# EAGLE design DAQ (EAGLE 7.6.0)
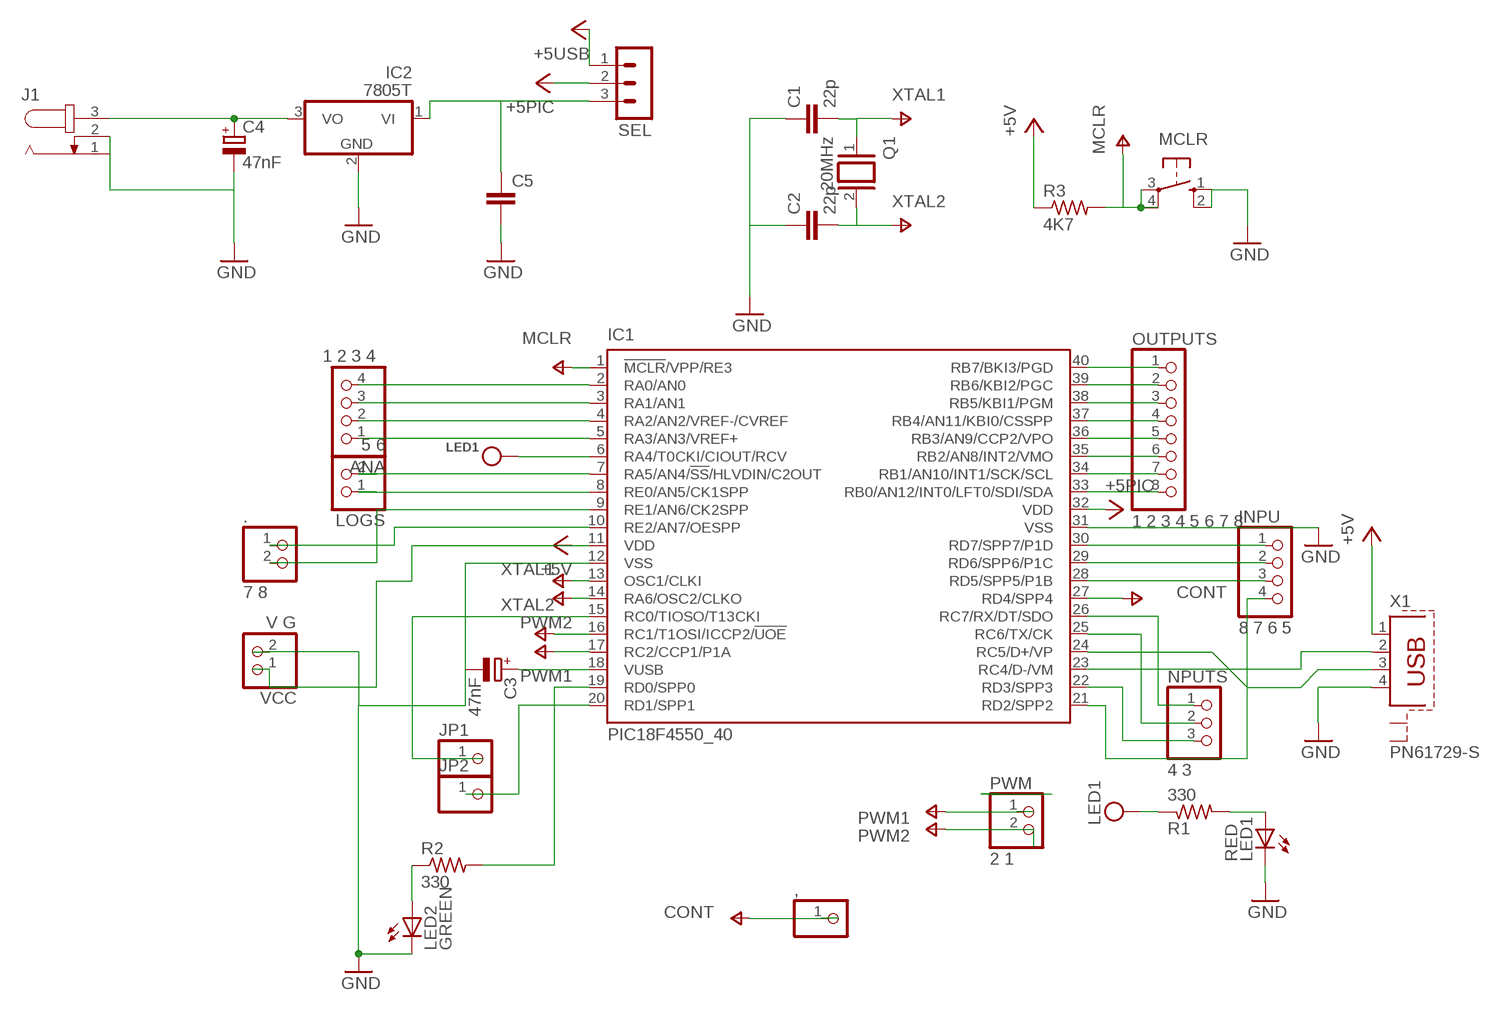
[diagram p0: schematic, sheet 1]

## Parts
,  PINHD-1X1  [1X01]
.  7 8  PINHD-1X2  [1X02]
ANA  1 2 3 4  PINHD-1X4  [1X04]
C1  22p  C-EU025-024X044  [C025-024X044]
C2  22p  C-EU025-024X044  [C025-024X044]
C3  47nF  CPOL-EUE2,5-6E  [E2,5-6E]
C4  47nF  CPOL-EUE2,5-6E  [E2,5-6E]
C5  C-EU050-035X075  [C050-035X075]
IC1  PIC18F4550_40  [DIL40]
IC2  7805T  [TO220H]
INPU  8 7 6 5  PINHD-1X4  [1X04]
J1  JACK-PLUG0  [SPC4077]
JP1  PINHD-1X1  [1X01]
JP2  PINHD-1X1  [1X01]
LED1  RED  TLLR4400  [LED3MM]
LED2  GREEN  TLLG4400  [LED3MM]
LOGS  5 6  PINHD-1X2  [1X02]
MCLR  10-XX  [B3F-10XX]
NPUTS  4 3  PINHD-1X3  [1X03]
OUTPUTS  1 2 3 4 5 6 7 8  PINHD-1X8  [1X08]
PWM  2 1  PINHD-1X2  [1X02]
Q1  20MHz  XTAL/S  [QS]
R1  330  R-US_0207/10  [0207/10]
R2  330  R-US_0207/10  [0207/10]
R3  4K7  R-US_0207/10  [0207/10]
SEL  MA03-1  [MA03-1]
VCC  V G  PINHD-1X2  [1X02]
X1  PN61729-S  [PN61729-S]

## Nets
+5PIC: IC1.11(VDD) IC1.32(VDD) R3.1 SEL.2 VCC.1 ; supply symbol labelled +5V
+5USB: SEL.1 X1.1 ; supply symbol labelled +5V
GND: C1.1 C2.1 C3.- C4.- C5.2 IC1.12(VSS) IC1.31(VSS) IC2.2(GND) J1.1 J1.2 LED1.K(C) LED2.K(C) MCLR.1(S) MCLR.2(S1) VCC.2 X1.4
MCLR: IC1.1(!MCLR!/VPP/RE3) MCLR.3(P) MCLR.4(P1) R3.2
N$1: IC1.23(RC4/D-/VM) X1.2
N$2: IC1.30(RD7/SPP7/P1D) INPU.1
N$3: IC1.40(RB7/BKI3/PGD) OUTPUTS.1
N$5: LED2.A R2.1
N$6: IC1.25(RC6/TX/CK) NPUTS.2
N$7: LED1.A R1.2
N$8: IC1.39(RB6/KBI2/PGC) OUTPUTS.2
N$9: IC1.38(RB5/KBI1/PGM) OUTPUTS.3
N$10: IC1.37(RB4/AN11/KBI0/CSSPP) OUTPUTS.4
N$11: IC1.36(RB3/AN9/CCP2/VPO) OUTPUTS.5
N$12: IC1.35(RB2/AN8/INT2/VMO) OUTPUTS.6
N$13: IC1.34(RB1/AN10/INT1/SCK/SCL) OUTPUTS.7
N$14: IC1.33(RB0/AN12/INT0/LFT0/SDI/SDA) OUTPUTS.8
N$15: IC1.24(RC5/D+/VP) X1.3
N$16: IC1.29(RD6/SPP6/P1C) INPU.2
N$17: IC1.28(RD5/SPP5/P1B) INPU.3
N$18: IC1.22(RD3/SPP3) NPUTS.3
N$19: IC1.15(RC0/TIOSO/T13CKI) JP1.1
N$20: C3.+ IC1.18(VUSB)
N$21: IC1.21(RD2/SPP2) INPU.4
N$22: IC1.19(RD0/SPP0) R2.2
N$23: ANA.4 IC1.2(RA0/AN0)
N$24: ANA.3 IC1.3(RA1/AN1)
N$25: ANA.2 IC1.4(RA2/AN2/VREF-/CVREF)
N$26: ANA.1 IC1.5(RA3/AN3/VREF+)
N$27: IC1.7(RA5/AN4/!SS!/HLVDIN/C2OUT) LOGS.2
N$28: IC1.8(RE0/AN5/CK1SPP) LOGS.1
N$29: IC1.20(RD1/SPP1) JP2.1
N$31: ..2 IC1.9(RE1/AN6/CK2SPP)
N$32: ..1 IC1.10(RE2/AN7/OESPP)
N$131: C4.+ IC2.3(VO) J1.3
N$132: C5.1 IC2.1(VI) SEL.3
N$137: IC1.26(RC7/RX/DT/SDO) NPUTS.1
PWM1: IC1.17(RC2/CCP1/P1A) PWM.1
PWM2: IC1.16(RC1/T1OSI/ICCP2/!UOE) PWM.2
V+: ,.1 IC1.27(RD4/SPP4) ; supply symbol labelled CONT
VCC: IC1.6(RA4/T0CKI/CIOUT/RCV) R1.1 ; supply symbol labelled LED1
XTAL1: C1.2 IC1.13(OSC1/CLKI) Q1.1
XTAL2: C2.2 IC1.14(RA6/OSC2/CLKO) Q1.2
Unconnected: X1.S1 X1.S2

## Library data of the parts
, JP1 JP2 = pinhead:PINHD-1X1: PIN HEADER
. LOGS PWM VCC = pinhead:PINHD-1X2: PIN HEADER
ANA INPU = pinhead:PINHD-1X4: PIN HEADER
C1 C2 C5 = rcl:C-EU: CAPACITOR, European symbol
C3 C4 = resistor:CPOL-EU: POLARIZED CAPACITOR, European symbol
IC1 = microchip:PIC18F4*_40: USB Microcontrollers with nanoWatt Technology High-Performance, Enhanced Flash, 28/40/44-Pin, Source: http://ww1.microchip.com/downloads/en/devicedoc/39632c.pdf; MF: MICROCHIP; MPN: PIC18F4550-I/P; OC_FARNELL: 9321357; OC_NEWARK: 74K8623
IC2 = linear:78*: Positive VOLTAGE REGULATOR Source: http://cache.national.com/ds/LM/LM78L05.pdf http://www.fairchildsemi.com/ds/LM/LM7805.pdf
J1 = con-jack:JACK-PLUG: DC POWER JACK Power Jack, DC, Right Angle, Through Hole, Rated 5A at 16VDC, PC Terminals Distributor: Farnell (www.Farnell.de) Drawing: 84N1161.pdf / 84N1162.pdf Manufacturer: SPC Technology (www.spctechnology.com) Type: SPC4077 / SPC 4078; OC_FARNELL: unknown; OC_NEWARK: unknown
LED1 = led:TLLR4400: Low Current (2mA) LED 3 mm Tinted Diffused Package color RED Source: Data sheet <http://www.farnell.com/datasheets/391100.pdf>; MF: VISHAY SEMICONDUCTOR; OC_FARNELL: 1612437
LED2 = led:TLLG4400: Low Current (2mA) LED 3 mm Tinted Diffused Package color GREEN Source: Data sheet <http://www.farnell.com/datasheets/391098.pdf>; MF: VISHAY SEMICONDUCTOR; OC_FARNELL: 1612435
MCLR = switch-omron:10-XX: OMRON SWITCH; MPN: B3F-1000; OC_FARNELL: 176432; OC_NEWARK: 36M3542
NPUTS = pinhead:PINHD-1X3: PIN HEADER
OUTPUTS = pinhead:PINHD-1X8: PIN HEADER
Q1 = special:XTAL/S: CRYSTAL
R1-R3 = resistor:R-US_: RESISTOR, American symbol
SEL = con-lstb:MA03-1: PIN HEADER; OC_FARNELL: unknown; OC_NEWARK: unknown
X1 = con-berg:PN61729-S: BERG USB connector; OC_FARNELL: unknown; OC_NEWARK: unknown

## Board
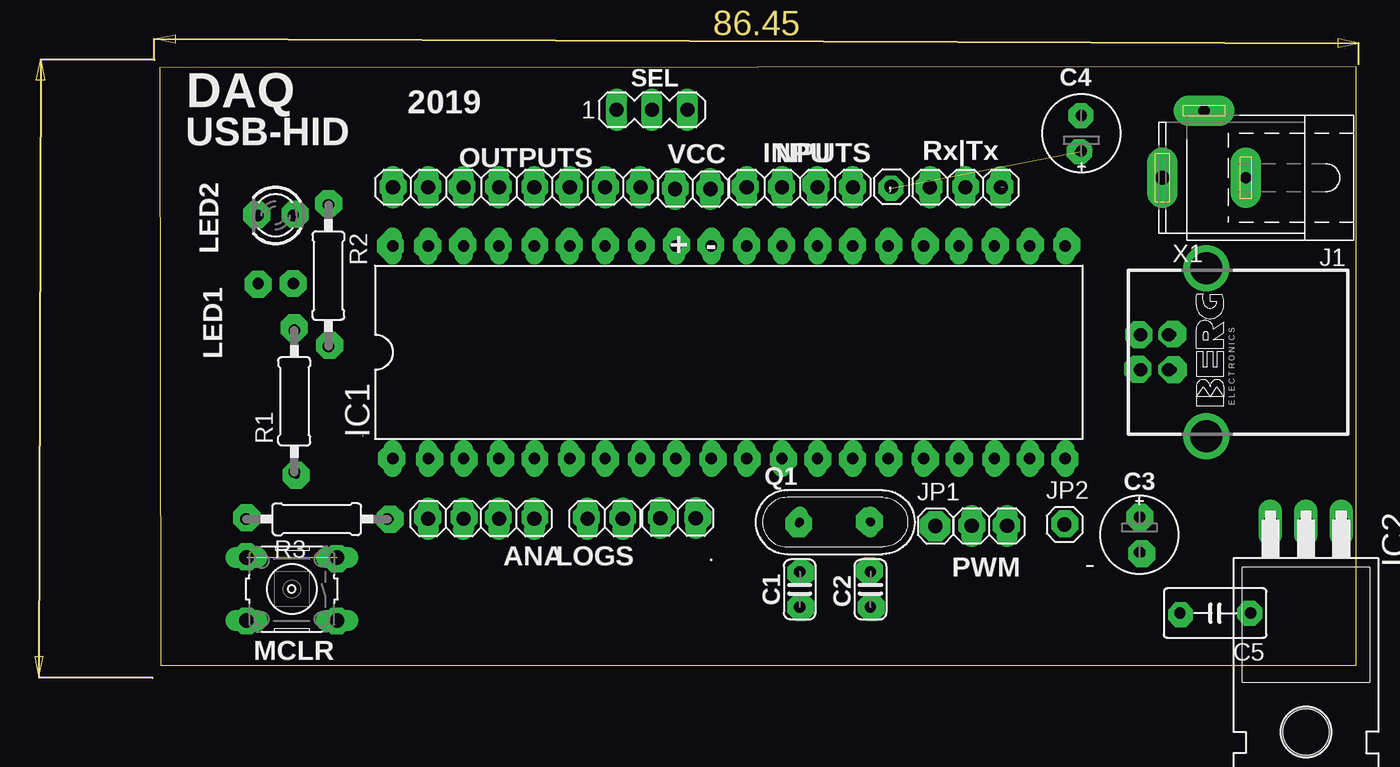
[diagram p1: board, top side]
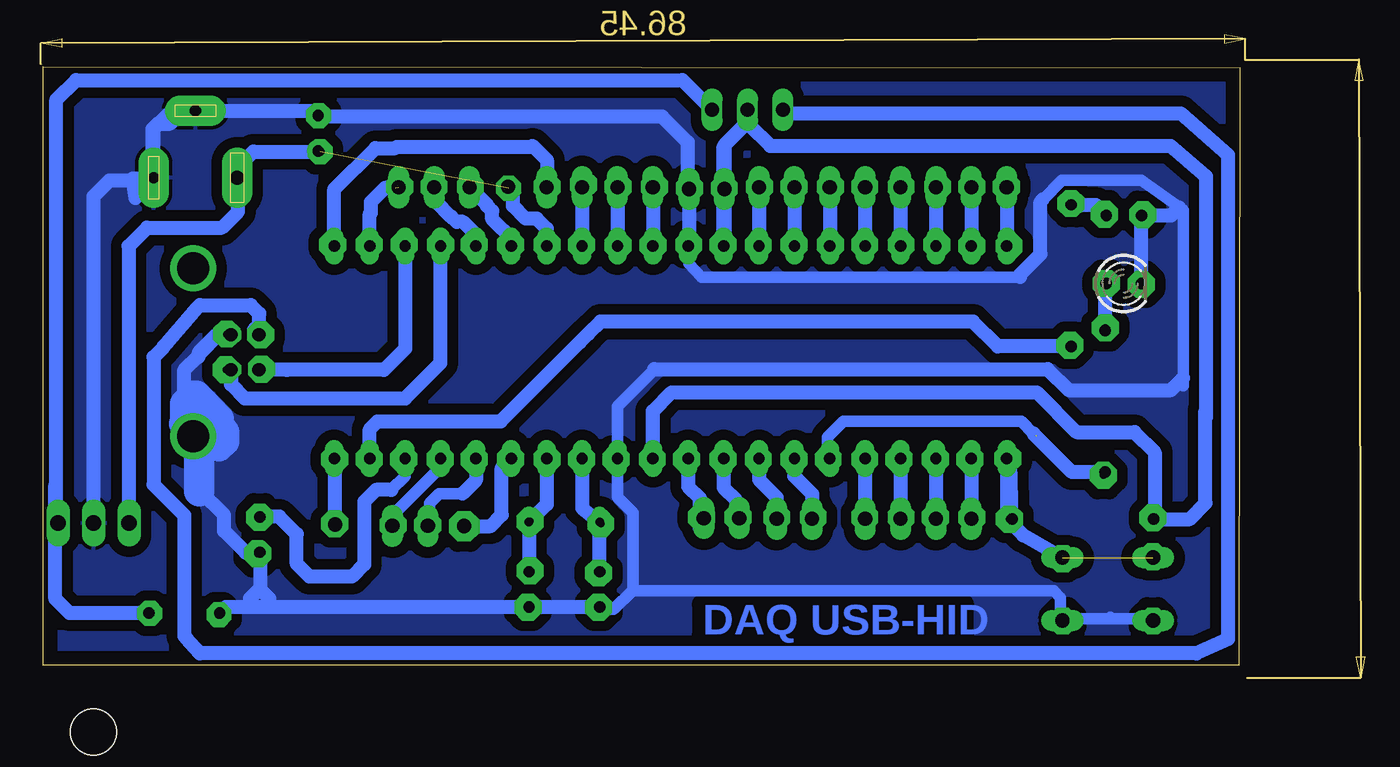
[diagram p2: board, bottom side, seen from below]

Size 85.92 x 42.93 mm. Coordinates in mm from the lower left corner, seen from the top.
Outline: 0.08,0 85.92,0 85.92,42.93 0,42.86 0.08,0
Copper layers (1*16): Top 0.035mm / dielectric 1.5mm / Bottom 0.035mm
Design rules "default *": minimum track width 10mil, minimum drill 24mil, track to track 30mil, track to pad 30mil, pad to pad 30mil, via to via 30mil, smd to smd 30mil, copper to edge 40mil, drill to drill 8mil, minimum pad ring 10mil, minimum via ring 8mil, stop-mask expansion 4mil, vias tented up to drill 0mil, thermal gap 10mil

### Footprints (pad centres in the part's own frame; a part is rotated, then mirrored left to right if it is on the bottom)
1X01 = drill 1.016 octagon: 1 0,0
1X02 = drill 1.016 long: 1 -1.27,0; 2 1.27,0
1X04 = drill 1.016 long: 1 -3.81,0; 2 -1.27,0; 3 1.27,0; 4 3.81,0
C025-024X044 = drill 0.813 octagon: 1 -1.27,0; 2 1.27,0
E2,5-6E = drill 0.813 pad 1.575: + -1.27,0 | drill 0.813 pad 1.575 octagon: - 1.27,0
C050-035X075 = drill 0.813 octagon: 1 -2.54,0; 2 2.54,0
DIL40 = drill 0.813 long: 1 -24.13,-7.62; 2 -21.59,-7.62; 3 -19.05,-7.62; 4 -16.51,-7.62; 5 -13.97,-7.62; 6 -11.43,-7.62; 7 -8.89,-7.62; 8 -6.35,-7.62; 9 -3.81,-7.62; 10 -1.27,-7.62; 11 1.27,-7.62; 12 3.81,-7.62; 13 6.35,-7.62; 14 8.89,-7.62; 15 11.43,-7.62; 16 13.97,-7.62; 17 16.51,-7.62; 18 19.05,-7.62; 19 21.59,-7.62; 20 24.13,-7.62; 21 24.13,7.62; 22 21.59,7.62; 23 19.05,7.62; 24 16.51,7.62; 25 13.97,7.62; 26 11.43,7.62; 27 8.89,7.62; 28 6.35,7.62; 29 3.81,7.62; 30 1.27,7.62; 31 -1.27,7.62; 32 -3.81,7.62; 33 -6.35,7.62; 34 -8.89,7.62; 35 -11.43,7.62; 36 -13.97,7.62; 37 -16.51,7.62; 38 -19.05,7.62; 39 -21.59,7.62; 40 -24.13,7.62
TO220H = drill 1.118 long: 1 -2.54,-10.16; 2 0,-10.16; 3 2.54,-10.16 | hole 3.302: 0,4.826
SPC4077 = drill 0.8 pad 2.184 long: 1 -3,0; 2 0,-4.8 | drill 1 pad 2.184 long: 3 3,0
LED3MM = drill 0.813 octagon: A -1.27,0; K 1.27,0
B3F-10XX = drill 1.016 long: 1 -3.251,2.261; 2 3.251,2.261; 3 -3.251,-2.261; 4 3.251,-2.261
1X03 = drill 1.016 long: 1 -2.54,0; 2 0,0; 3 2.54,0
1X08 = drill 1.016 long: 1 -8.89,0; 2 -6.35,0; 3 -3.81,0; 4 -1.27,0; 5 1.27,0; 6 3.81,0; 7 6.35,0; 8 8.89,0
QS = drill 0.61 long: 1 -2.54,0; 2 2.54,0
0207/10 = drill 0.813 octagon: 1 -5.08,0; 2 5.08,0
MA03-1 = drill 1.016 long: 1 -2.54,0; 2 0,0; 3 2.54,0
PN61729-S = drill 0.95 octagon: 1 1.25,4.71; 2 -1.25,4.71; 3 -1.25,2.71; 4 1.25,2.71 | drill 2.3 pad 2.9: S1 -6.02,0; S2 6.02,0

### Placement (x,y rotation side)
,  52.54,34.33 0 top
.  37.22,10.55 180 top
ANA  23.1,10.52 180 top
C1  45.96,5.44 90 top
C2  51.04,5.44 90 top
C3  70.34,9.37 270 top
C4  66.18,38.18 90 top
C5  75.78,3.73 180 top
IC1  40.88,22.45 0 top
IC2  82.29,0.04 180 top
INPU  45.96,34.29 0 top
J1  74.98,34.98 180 top
JP1  55.7,9.98 0 top
JP2  64.96,10.1 0 top
LED1  8.35,27.38 0 bottom
LED2  8.33,32.27 180 top
LOGS  31.99,10.52 180 top
MCLR  9.5,5.46 180 top
NPUTS  57.84,34.29 0 top
OUTPUTS  25.64,34.29 0 top
PWM  59.57,10 180 top
Q1  48.5,10.26 0 top
R1  9.67,18.94 90 top
R2  12.12,27.95 270 top
R3  11.29,10.48 0 top
SEL  35.35,39.85 0 top
VCC  38.28,34.16 0 top
X1  75.14,22.45 90 top

### Tracks (layer width: path | path; a pad name or v marks a point on that pad's centre or on a via)
+5PIC
  Bottom 1.016: SEL.2 35.35,38.98 36.99,37.34 36.99,34.18 VCC.1 37.01,30.14 IC1.32 37.07,37.22 35.24,39.05 | IC1.11 42.15,18.24 40.8,19.58 14.59,19.58 11.73,16.73 7.58,16.73 6.13,15.28 6.13,10.55 R3.1 3.62,10.48 2.47,11.62 2.47,18.25 2.43,18.29 | 2.43,17.79 2.43,18.29 | 2.43,18.29 2.43,35.05 4.99,37.26 33.71,37.26 35.24,38.79 35.24,39.05 | 35.24,39.05 35.24,39.47
+5USB
  Bottom 1.016: SEL.1 32.57,39.85 32.3,39.59 4.26,39.59 0.87,36.61 0.87,1.87 3.12,0.84 74.67,0.84 75.66,1.98 75.78,2.1 75.78,10.75 77.99,12.95 77.99,22.1 77.26,22.82 77.26,22.86 74.86,25.64 74.67,25.83 71.01,25.83 70.4,25.22 70.4,24.44 70.79,24.06 X1.1
GND
  Bottom 0.813: 43.62,5.33 43.57,5.39 43.57,10.93 44.69,12.05 IC1.12 44.69,18.59 42.03,21.25 | 43.62,5.33 44.96,4 45.79,4 C1.1 | 4.08,20.06 4.08,20.61 4.08,32.64 4.36,32.84 7.07,34.8 12.77,34.8 14.16,33.41 | IC1.31 39.57,30.03 39.57,28.79 38.67,27.85 15.77,27.85 | 9.81,3.32 12.62,3.32 MCLR.1 | 12.52,3.69 12.89,3.32 | 12.89,3.32 9.41,3.32 | 9.41,3.32 6.37,3.32 MCLR.2 | 9.29,3.44 9.41,3.32 | 12.89,3.32 12.89,4.85 13.37,5.33 43.62,5.33
  Bottom 1.016: X1.4 73.48,23.7 | 73.48,23.7 74.73,22.45 | C1.1 C2.1 70.63,4.17 | VCC.2 39.55,33.61 | 39.55,33.61 39.55,30.14 IC1.31 | 74.94,39.81 J1.2 | J1.2 75.17,39.59 76.88,39.59 77.98,38.49 J1.1 78.02,34.94 78.33,34.94 | 79.28,33.53 79.47,34.94 78.33,34.94 | 78.33,34.94 78.06,35.2 78.06,35.47 | 78.06,35.47 78.06,38.48 77.68,38.86 76.81,38.86 75.93,39.74 | 39.55,33.61 39.66,33.72 39.66,37.53 41.49,39.36 66.09,39.36 C4.- 65.88,39.74 74.94,39.74 J1.2 | IC2.2 82.29,33.64 81.15,34.79 78.75,34.79 78.06,35.47 | 70.63,4.17 72.81,4.17 C5.2 | 70.29,5.41 70.34,5.46 C3.- 71.38,8.1 72.92,9.64 72.92,10.78 74.56,12.42 74.63,12.42 | 69.68,4.8 70.29,5.41 | 70.29,5.41 70.44,5.41 71.05,4.8 71.05,4.59 70.63,4.17 | 73.48,23.7 73.48,23.63 74.71,22.4 | 75.78,17.34 75.78,21.18 74.75,22.21 | 74.75,22.21 74.75,22.29 73.3,23.74 | 74.75,22.1 74.75,22.21 | 73.3,23.74 73.11,23.93 72.73,23.93 72.54,23.74 73.3,23.74 | 74.63,12.42 74.71,12.42 74.82,12.54 74.75,12.54 74.63,12.42 | 4.36,32.84 4.93,32.27 LED2.K 7.08,32.25 LED1.K | 15.77,27.85 15.77,28.04 14.32,29.49 14.32,33.25 14.16,33.41 | 42.03,21.25 13.81,21.25 12.3,19.74 4.95,19.74 4.08,20.61
  Bottom 2.184: 74.71,12.47 74.71,16.95 73.68,17.98 73.68,17.49 72.92,16.73 72.92,16.08 73.3,15.7 73.3,17.68 74.94,19.32 75.13,19.32 75.7,18.75 75.7,17.41 75.78,17.34
  pour Bottom: -0.25,42.95 -0.56,-0.14 85.8,-0.18 86.1,42.91
MCLR  (1 unrouted)
  Bottom 1.016: R3.2 16.49,14.58 IC1.1 16.75,10.52 15.55,9.32 MCLR.3
N$1
  Bottom 1.016: IC1.23 59.93,22.71 61.45,21.18 68.41,21.18 X1.2
N$2
  Bottom 1.016: INPU.1 IC1.30
N$3
  Bottom 1.016: OUTPUTS.1 IC1.40
N$5
  Bottom 1.016: R2.1 10.36,33.03 LED2.A
N$6
  Bottom 1.016: IC1.25 54.85,30.89 55.77,31.81 56.23,31.81 56.61,32.2 56.65,32.2 57.68,33.22 57.68,34.13 NPUTS.2
N$7
  Bottom 1.016: R1.2 9.67,27.33 LED1.A
N$8
  Bottom 1.016: OUTPUTS.2 IC1.39
N$9
  Bottom 1.016: OUTPUTS.3 IC1.38
N$10
  Bottom 1.016: OUTPUTS.4 IC1.37
N$11
  Bottom 1.016: OUTPUTS.5 IC1.36
N$12
  Bottom 1.016: OUTPUTS.6 IC1.35
N$13
  Bottom 1.016: OUTPUTS.7 IC1.34
N$14
  Bottom 1.016: OUTPUTS.8 IC1.33
N$15
  Bottom 1.016: IC1.24 57.39,21.69 59.93,19.15 71.43,19.15 72.43,20.15 X1.3
N$16
  Bottom 1.016: INPU.2 IC1.29
N$17
  Bottom 1.016: INPU.3 IC1.28
N$18  (1 unrouted)
  Bottom 1.016: IC1.22 62.47,32.4 62.4,32.46 62.4,33.22 61.38,34.25 60.61,34.25
N$19
  Bottom 1.016: JP1.1 53.79,9.98 52.99,10.78 52.99,14.15 IC1.15
N$20
  Bottom 0.813: IC1.18 59.93,13.56 60.92,12.57
  Bottom 1.016: C3.+ 70.32,10.67 68.96,10.67 67.7,9.41 67.7,7.28 66.78,6.36 63.74,6.36 62.86,7.24 62.86,11.73 62.02,12.57 60.92,12.57
N$21
  Bottom 1.016: IC1.21 65.01,34.16 62.06,37.11 60.61,37.11 60.54,37.19 50.71,37.19 | INPU.4 49.75,34.31 49.75,36.23 50.71,37.19 | 50.71,37.19 50.78,37.26
N$22
  Bottom 1.016: IC1.19 62.47,16.93 61.91,17.49 53.07,17.49 47.39,23.17 46.78,23.78 45.91,24.65 19.16,24.65 17.38,22.87 R2.2
N$23
  Bottom 1.016: IC1.2 ANA.4
N$24
  Bottom 1.016: IC1.3 ANA.3
N$25
  Bottom 1.016: IC1.4 ANA.2
N$26
  Bottom 1.016: IC1.5 ANA.1
N$27
  Bottom 1.016: IC1.7 31.99,13.56 30.72,12.29 LOGS.2
N$28
  Bottom 1.016: IC1.8 34.53,13.31 33.26,12.04 LOGS.1
N$29
  Bottom 1.016: JP2.1 64.96,14.78 IC1.20
N$30
  pour Bottom: -0.37,43.43 -0.45,0.01 86,-0.29 86.08,43.13
N$31
  Bottom 1.016: IC1.9 37.07,12.74 36.18,11.85 36.18,10.6 36.1,10.52 ..2
N$32
  Bottom 1.016: IC1.10 39.61,12.82 38.8,12.01 38.8,10.44 | 38.8,10.44 38.8,9.85 | ..1 38.64,10.29 38.8,10.44
N$33  (via drill 0.5 pad 1.93)
  other vias: 16.58,30.08
N$34  (via drill 0.5 pad 1.93)
  other vias: 19.24,30.08
N$35  (via drill 0.5 pad 1.93)
  other vias: 21.76,30.18
N$36  (via drill 0.5 pad 1.93)
  other vias: 70.3,23.7
N$37  (via drill 0.5 pad 1.93)
  other vias: 72.74,23.76
N$38  (via drill 0.5 pad 1.93)
  other vias: 70.24,21.25
N$39  (via drill 0.5 pad 1.93)
  other vias: 72.79,21.2
N$40  (via drill 0.5 pad 1.93)
  other vias: 24.32,30.18
N$41  (via drill 0.5 pad 1.93)
  other vias: 26.94,30.18
N$42  (via drill 0.5 pad 1.93)
  other vias: 29.4,30.18
N$43  (via drill 0.5 pad 1.93)
  other vias: 32.02,30.18
N$44  (via drill 0.5 pad 1.93)
  other vias: 34.59,30.13
N$45  (via drill 0.5 pad 1.93)
  other vias: 37.1,30.18
N$46  (via drill 0.5 pad 1.93)
  other vias: 39.57,30.18
N$47  (via drill 0.5 pad 1.93)
  other vias: 42.13,30.13
N$48  (via drill 0.5 pad 1.93)
  other vias: 44.65,30.13
N$49  (via drill 0.5 pad 1.93)
  other vias: 47.27,30.18
N$50  (via drill 0.5 pad 1.93)
  other vias: 49.73,30.18
N$51  (via drill 0.5 pad 1.93)
  other vias: 52.35,30.18
N$52  (via drill 0.5 pad 1.93)
  other vias: 54.97,30.18
N$53  (via drill 0.5 pad 1.93)
  other vias: 57.38,30.18
N$54  (via drill 0.5 pad 1.93)
  other vias: 60,30.18
N$55  (via drill 0.5 pad 1.93)
  other vias: 62.51,30.18
N$56  (via drill 0.5 pad 1.93)
  other vias: 65.13,30.18
N$57  (via drill 0.5 pad 1.93)
  other vias: 60.33,34.34
N$58  (via drill 0.5 pad 1.93)
  other vias: 57.86,34.34
N$59  (via drill 0.5 pad 1.93)
  other vias: 55.25,34.34
N$60  (via drill 0.5 pad 1.93)
  other vias: 49.73,34.34
N$61  (via drill 0.5 pad 1.93)
  other vias: 47.11,34.49
N$62  (via drill 0.5 pad 1.93)
  other vias: 44.65,34.34
N$63  (via drill 0.5 pad 1.93)
  other vias: 42.03,34.34
N$64  (via drill 0.5 pad 1.93)
  other vias: 34.48,34.34
N$65  (via drill 0.5 pad 1.93)
  other vias: 32.02,34.34
N$66  (via drill 0.5 pad 1.93)
  other vias: 29.4,34.34
N$67  (via drill 0.5 pad 1.93)
  other vias: 26.94,34.34
N$68  (via drill 0.5 pad 1.93)
  other vias: 24.32,34.34
N$69  (via drill 0.5 pad 1.93)
  other vias: 21.7,34.34
N$70  (via drill 0.5 pad 1.93)
  other vias: 19.24,34.34
N$71  (via drill 0.5 pad 1.93)
  other vias: 16.77,34.34
N$72  (via drill 0.5 pad 1.93)
  other vias: 19.24,10.62
N$73  (via drill 0.5 pad 1.93)
  other vias: 21.86,10.62
N$74  (via drill 0.5 pad 1.93)
  other vias: 24.32,10.62
N$75  (via drill 0.5 pad 1.93)
  other vias: 26.94,10.62
N$76  (via drill 0.5 pad 1.93)
  other vias: 30.63,10.62
N$77  (via drill 0.5 pad 1.93)
  other vias: 33.25,10.62
N$78  (via drill 0.5 pad 1.93)
  other vias: 36.03,10.62
N$79  (via drill 0.5 pad 1.93)
  other vias: 38.64,10.62
N$81  (via drill 0.5 pad 1.93)
  other vias: 45.88,10.16
N$82  (via drill 0.5 pad 1.93)
  other vias: 50.96,10.31
N$83  (via drill 0.5 pad 1.93)
  other vias: 46.03,6.62
N$84  (via drill 0.5 pad 1.93)
  other vias: 46.03,4.15
N$85  (via drill 0.5 pad 1.93)
  other vias: 51.12,4.15
N$86  (via drill 0.5 pad 1.93)
  other vias: 50.96,6.77
N$87  (via drill 0.5 pad 1.93)
  other vias: 58.33,10.05
N$88  (via drill 0.5 pad 1.93)
  other vias: 60.79,10.05
N$89  (via drill 0.5 pad 2.18)
  other vias: 55.69,9.97
N$90  (via drill 0.5 pad 1.93)
  other vias: 64.98,10.16
N$91  (via drill 0.5 pad 1.93)
  other vias: 70.37,10.62
N$92  (via drill 0.5 pad 1.93)
  other vias: 70.52,8
N$93  (via drill 0.5 pad 1.93)
  other vias: 12.22,22.96
N$94  (via drill 0.5 pad 1.93)
  other vias: 12.14,33.13
N$95  (via drill 0.5 pad 1.93)
  other vias: 9.73,32.37
N$96  (via drill 0.5 pad 1.93)
  other vias: 6.97,32.33
N$97  (via drill 0.5 pad 1.93)
  other vias: 9.67,24.22
N$98  (via drill 0.5 pad 1.93)
  other vias: 9.59,27.39
N$99  (via drill 0.5 pad 1.93)
  other vias: 6.27,7.79
N$100  (via drill 0.5 pad 1.93)
  other vias: 6.27,3.17
N$101  (via drill 0.5 pad 1.93)
  other vias: 12.73,3.17
N$102  (via drill 0.5 pad 1.93)
  other vias: 12.73,7.64
N$103  (via drill 0.5 pad 1.93)
  other vias: 7.09,27.34
N$104  (via drill 0.5 pad 1.93)
  other vias: 9.8,13.62
N$105  (via drill 0.5 pad 1.93)
  other vias: 16.54,10.49
N$106  (via drill 0.5 pad 1.93)
  other vias: 6.26,10.57
N$107  (via drill 0.5 pad 1.93)
  other vias: 16.68,14.83
N$108  (via drill 0.5 pad 1.93)
  other vias: 19.39,14.78
N$109  (via drill 0.5 pad 1.93)
  other vias: 21.86,14.78
N$110  (via drill 0.5 pad 1.93)
  other vias: 24.48,14.78
N$111  (via drill 0.5 pad 1.93)
  other vias: 26.94,14.78
N$112  (via drill 0.5 pad 1.93)
  other vias: 29.56,14.78
N$113  (via drill 0.5 pad 1.93)
  other vias: 32.02,14.78
N$114  (via drill 0.5 pad 1.93)
  other vias: 34.59,14.78
N$115  (via drill 0.5 pad 1.93)
  other vias: 37.1,14.78
N$116  (via drill 0.5 pad 1.93)
  other vias: 39.72,14.78
N$117  (via drill 0.5 pad 1.93)
  other vias: 42.19,14.78
N$118  (via drill 0.5 pad 1.93)
  other vias: 44.8,14.78
N$119  (via drill 0.5 pad 1.93)
  other vias: 47.27,14.78
N$120  (via drill 0.5 pad 1.93)
  other vias: 49.73,14.78
N$121  (via drill 0.5 pad 1.93)
  other vias: 52.35,14.78
N$122  (via drill 0.5 pad 1.93)
  other vias: 54.97,14.78
N$123  (via drill 0.5 pad 1.93)
  other vias: 57.43,14.78
N$124  (via drill 0.5 pad 1.93)
  other vias: 60.05,14.78
N$125  (via drill 0.5 pad 1.93)
  other vias: 62.51,14.78
N$126  (via drill 0.5 pad 1.93)
  other vias: 64.98,14.78
N$127  (via drill 1.1 pad 1.78)
  other vias: 75.13,28.46
N$128  (via drill 1.1 pad 1.78)
  other vias: 75.13,16.46
N$129  (via drill 0.5 pad 1.93)
  other vias: 37.03,34.21
N$130  (via drill 0.5 pad 1.93)
  other vias: 39.53,34.21
N$131
  Bottom 1.016: 71.49,35.46 J1.3 | J1.3 71.93,34.93 71.93,32.54 73.07,31.39 78.44,31.39 79.78,30.06 79.78,10.22 IC2.3 | J1.3 71.98,35.69 70.82,36.84 66.2,36.84 66.2,36.88 C4.+
N$132
  Bottom 1.016: SEL.3 40.03,41.99 83.55,41.99 84.96,40.58 84.96,10.07 | C5.1 84.01,3.73 85.03,4.76 85.03,9.64 | 85.03,9.64 85.03,12.92 | 85.03,9.64 84.96,9.72 84.96,10.07 | 84.96,10.07 IC2.1
N$133  (via drill 0.6 pad 1.78)  (1 unrouted)
  other vias: 66.02,36.84 52.5,34.21
N$134  (via drill 0.6 pad 1.78)
  other vias: 66.14,39.43
N$135  (via drill 0.6 pad 1.78)
  other vias: 78.25,3.73
N$136  (via drill 0.6 pad 1.78)
  other vias: 73.3,3.62
N$137
  Bottom 0.406: IC1.26 52.19,30.07 52.19,30.18
  Bottom 1.016: 52.19,30.18 52.19,30.52 53.68,32 53.68,32.58 54.06,32.96 54.06,33.05 NPUTS.1
PWM1
  Bottom 0.813: 60.83,10.76 57.45,14.13
  Bottom 1.016: 60.84,9.23 PWM.1 60.84,10.76 60.83,10.76 | 57.45,14.13 57.45,14.77 IC1.17
PWM2
  Bottom 0.813: 55.81,12.31 57.49,12.31 58.17,11.62 58.17,10.12
  Bottom 1.016: IC1.16 54.85,13.27 55.81,12.31 | 58.17,10.12 PWM.2
V+
  Bottom 1.016: IC1.27 49.77,31.33 50.48,32.04 51.28,32.04 52.19,32.96 52.19,33.99 ,.1
VCC  (1 unrouted)
  Bottom 0.406: 14.63,16.48 14.63,16.04
  Bottom 0.813: 14.63,16.42 14.82,16.61 15.69,17.49 28.46,17.49 29.6,16.34 29.6,14.99 IC1.6
  Bottom 1.016: R1.1 12.06,13.86 14.82,16.61
XTAL1
  Bottom 1.016: C1.2 Q1.1 47.23,11.28 IC1.13
XTAL2
  Bottom 1.016: C2.2 Q1.2 49.77,11.53 IC1.14

### Text on the board
Bottom: DAQ USB-HID
tPlace: DAQ | 2019 | USB-HID
tNames: Rx|Tx | + | - | D:/IMAGENES/UDP MICROCHIP.bmp